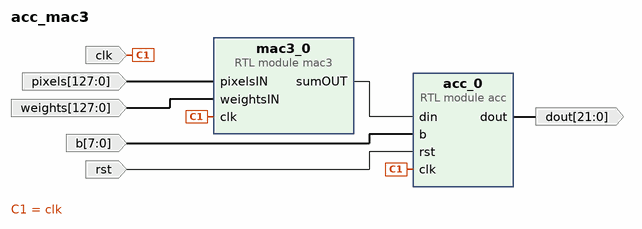
[diagram p0: block diagram of the top level]
# Vivado block design acc_mac3, xc7a35tcpg236-1, Vivado 2022.2
create_bd_design acc_mac3

create_bd_port -dir I clk
create_bd_port -dir I -from 127 -to 0 pixels
create_bd_port -dir I -from 127 -to 0 weights
create_bd_port -dir I -from 7 -to 0 b
create_bd_port -dir I -type rst rst
create_bd_port -dir O -from 21 -to 0 dout

create_bd_cell -type module -reference acc acc_0
create_bd_cell -type module -reference mac3 mac3_0

# ---- connections ----

connect_bd_net [get_bd_pins acc_0/dout] [get_bd_ports dout]
connect_bd_net -net b_0_1 [get_bd_ports b] [get_bd_pins acc_0/b]
connect_bd_net [get_bd_ports clk] [get_bd_pins acc_0/clk] [get_bd_pins mac3_0/clk]
connect_bd_net -net pixelsIN_0_1 [get_bd_ports pixels] [get_bd_pins mac3_0/pixelsIN]
connect_bd_net -net rst_0_1 [get_bd_ports rst] [get_bd_pins acc_0/rst]
connect_bd_net -net sumOUT [get_bd_pins mac3_0/sumOUT] [get_bd_pins acc_0/din]
connect_bd_net -net weightsIN_0_1 [get_bd_ports weights] [get_bd_pins mac3_0/weightsIN]

validate_bd_design
save_bd_design
